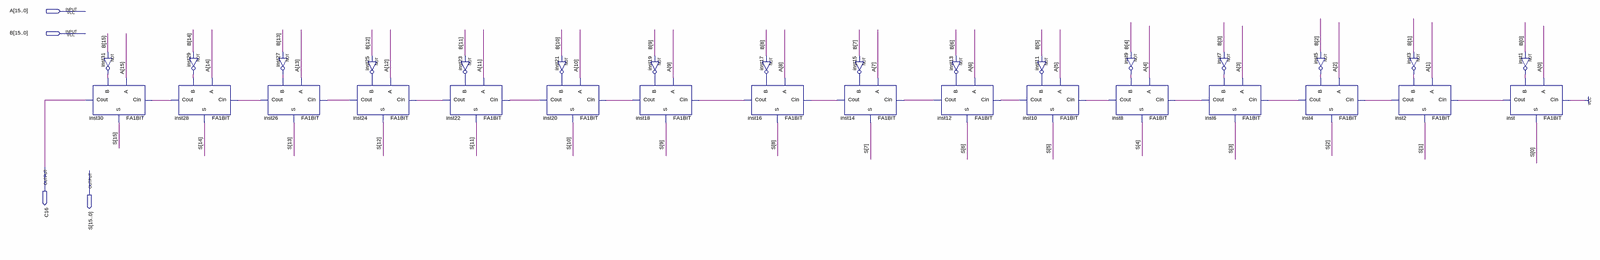
[diagram p0: schematic sheet, whole]
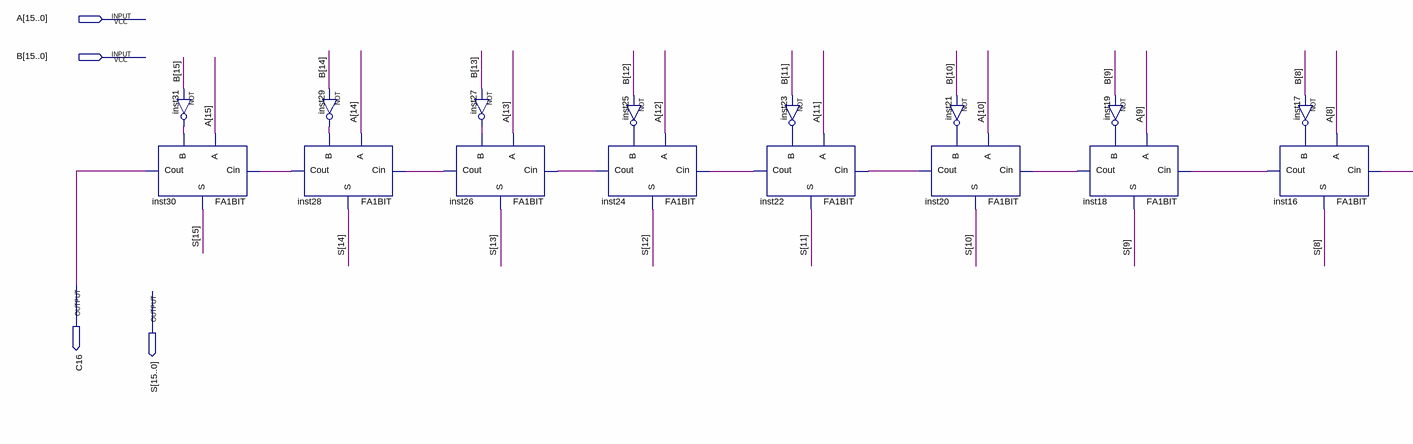
[diagram p1: schematic sheet, left part]
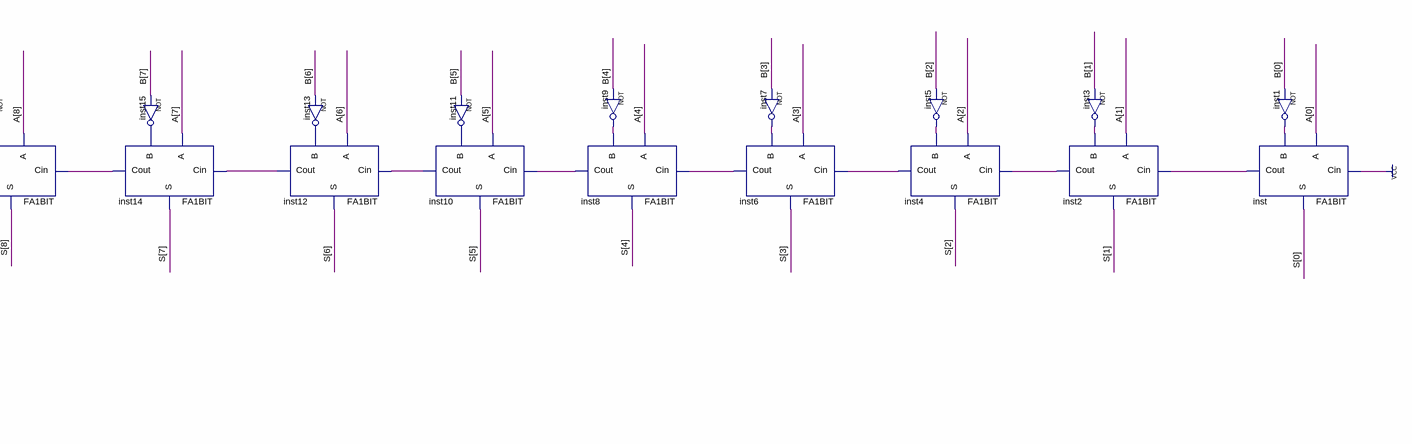
[diagram p2: schematic sheet, right part]
// Quartus schematic SUB16BIT.bdf as structural Verilog: 32 symbols, 4 pins
module SUB16BIT (
  input  [15:0] A,
  input  [15:0] B,
  output C16,
  output [15:0] S
);

  wire inst1_out, inst2_cout, inst3_out, inst4_cout, inst5_out, inst6_cout, inst7_out, inst8_cout, inst9_out,
       inst10_cout, inst11_out, inst12_cout, inst13_out, inst14_cout, inst15_out, inst16_cout, inst17_out,
       inst18_cout, inst19_out, inst20_cout, inst21_out, inst22_cout, inst23_out, inst24_cout, inst25_out,
       inst26_cout, inst27_out, inst28_cout, inst29_out, inst31_out, inst_cout;

  FA1BIT inst30 (.A(A[15]), .B(inst31_out), .Cin(inst28_cout), .Cout(C16), .S(S[15]));
  not inst31 (inst31_out, B[15]);
  FA1BIT inst28 (.A(A[14]), .B(inst29_out), .Cin(inst26_cout), .Cout(inst28_cout), .S(S[14]));
  not inst29 (inst29_out, B[14]);
  FA1BIT inst26 (.A(A[13]), .B(inst27_out), .Cin(inst24_cout), .Cout(inst26_cout), .S(S[13]));
  not inst27 (inst27_out, B[13]);
  FA1BIT inst24 (.A(A[12]), .B(inst25_out), .Cin(inst22_cout), .Cout(inst24_cout), .S(S[12]));
  not inst25 (inst25_out, B[12]);
  FA1BIT inst22 (.A(A[11]), .B(inst23_out), .Cin(inst20_cout), .Cout(inst22_cout), .S(S[11]));
  not inst23 (inst23_out, B[11]);
  not inst21 (inst21_out, B[10]);
  FA1BIT inst20 (.A(A[10]), .B(inst21_out), .Cin(inst18_cout), .Cout(inst20_cout), .S(S[10]));
  not inst19 (inst19_out, B[9]);
  FA1BIT inst18 (.A(A[9]), .B(inst19_out), .Cin(inst16_cout), .Cout(inst18_cout), .S(S[9]));
  FA1BIT inst16 (.A(A[8]), .B(inst17_out), .Cin(inst14_cout), .Cout(inst16_cout), .S(S[8]));
  not inst17 (inst17_out, B[8]);
  not inst15 (inst15_out, B[7]);
  FA1BIT inst14 (.A(A[7]), .B(inst15_out), .Cin(inst12_cout), .Cout(inst14_cout), .S(S[7]));
  not inst13 (inst13_out, B[6]);
  FA1BIT inst12 (.A(A[6]), .B(inst13_out), .Cin(inst10_cout), .Cout(inst12_cout), .S(S[6]));
  not inst11 (inst11_out, B[5]);
  FA1BIT inst10 (.A(A[5]), .B(inst11_out), .Cin(inst8_cout), .Cout(inst10_cout), .S(S[5]));
  not inst9 (inst9_out, B[4]);
  FA1BIT inst8 (.A(A[4]), .B(inst9_out), .Cin(inst6_cout), .Cout(inst8_cout), .S(S[4]));
  not inst7 (inst7_out, B[3]);
  FA1BIT inst6 (.A(A[3]), .B(inst7_out), .Cin(inst4_cout), .Cout(inst6_cout), .S(S[3]));
  FA1BIT inst4 (.A(A[2]), .B(inst5_out), .Cin(inst2_cout), .Cout(inst4_cout), .S(S[2]));
  not inst5 (inst5_out, B[2]);
  FA1BIT inst2 (.A(A[1]), .B(inst3_out), .Cin(inst_cout), .Cout(inst2_cout), .S(S[1]));
  not inst3 (inst3_out, B[1]);
  not inst1 (inst1_out, B[0]);
  FA1BIT inst (.A(A[0]), .B(inst1_out), .Cin(1'b1), .Cout(inst_cout), .S(S[0]));
endmodule
